# EAGLE schematic board0 (EAGLE 6.0)

## Sheet 1 of 7
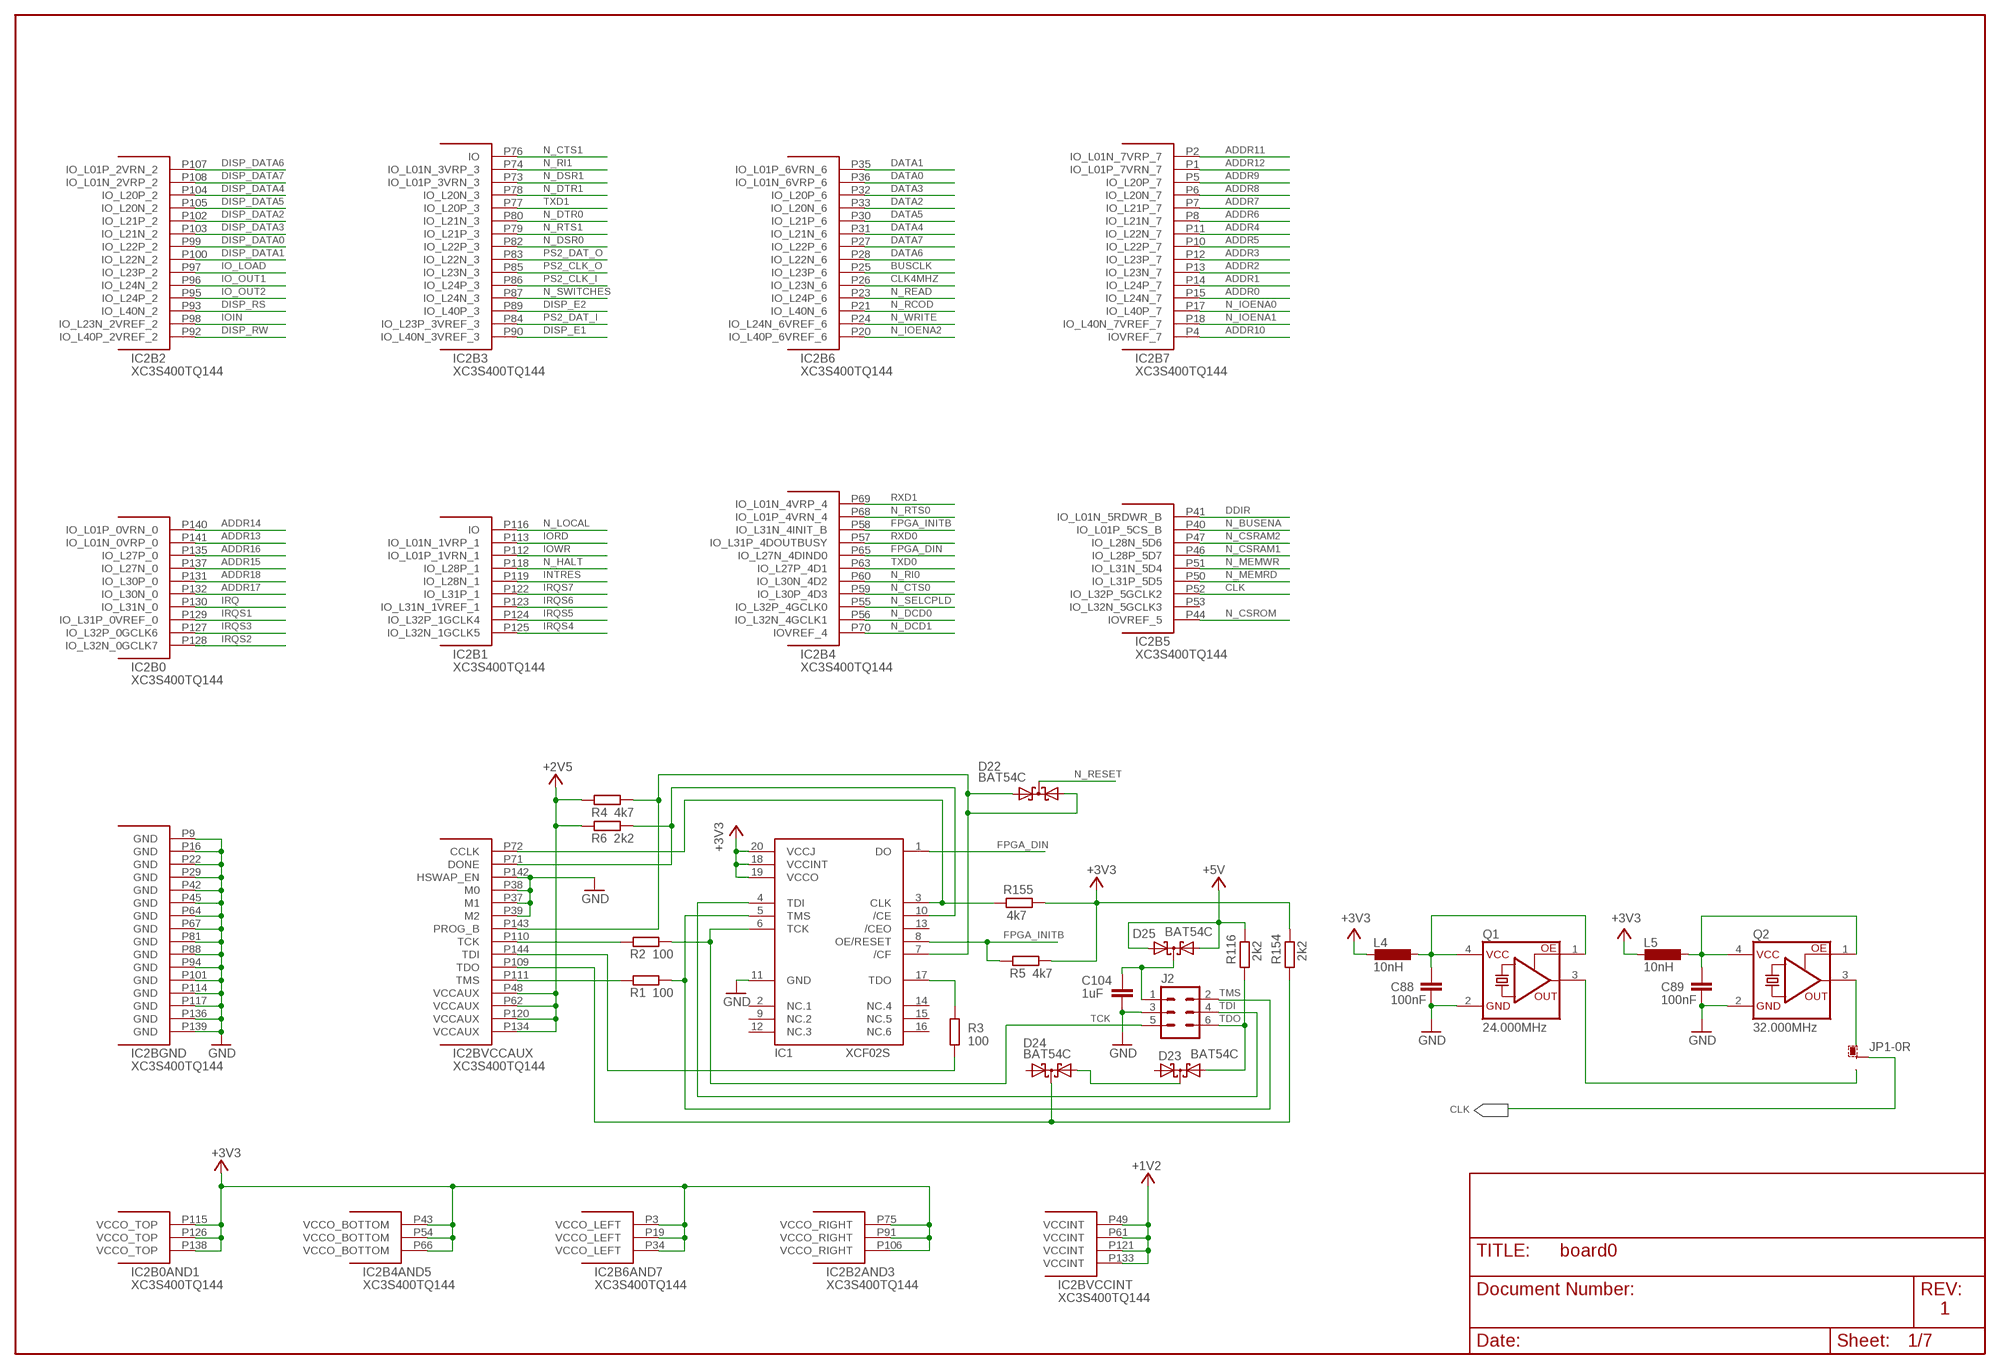
[diagram p0: schematic, sheet 1]

### Parts
C88  100nF  C-EUC0805  [C0805]
C89  100nF  C-EUC0805  [C0805]
C104  1uF  C-EUC0805  [C0805]
D22  BAT54C  BAS40-05  [SOT23]
D23  BAT54C  BAS40-05  [SOT23]
D24  BAT54C  BAS40-05  [SOT23]
D25  BAT54C  BAS40-05  [SOT23]
IC1  XCF02S  [VO20]
IC2  XC3S400TQ144  [TQ144]
J2  ML6  [ML6]
JP1  0R-JUMPA  [A0R-JMP]
L4  10nH  L-0805  [0805]
L5  10nH  L-0805  [0805]
Q1  24.000MHz  XO91  [XO91]
Q2  32.000MHz  XO91  [XO91]
R1  100  R-EU_M0805  [M0805]
R2  100  R-EU_M0805  [M0805]
R3  100  R-EU_M0805  [M0805]
R4  4k7  R-EU_M0805  [M0805]
R5  4k7  R-EU_M0805  [M0805]
R6  2k2  R-EU_M0805  [M0805]
R116  2k2  R-EU_M0805  [M0805]
R154  2k2  R-EU_M0805  [M0805]
R155  4k7  R-EU_M0805  [M0805]

### Nets
+1V2: IC2.P49(BVCCINT:VCCINT) IC2.P61(BVCCINT:VCCINT) IC2.P121(BVCCINT:VCCINT) IC2.P133(BVCCINT:VCCINT) ; also sheet 2
+2V5: IC2.P48(BVCCAUX:VCCAUX) IC2.P62(BVCCAUX:VCCAUX) IC2.P120(BVCCAUX:VCCAUX) IC2.P134(BVCCAUX:VCCAUX) R4.1 R6.1 ; also sheet 2
+3V3: IC1.18(VCCINT) IC1.19(VCCO) IC1.20(VCCJ) IC2.P3(B6AND7:VCCO_LEFT) IC2.P19(B6AND7:VCCO_LEFT) IC2.P34(B6AND7:VCCO_LEFT) IC2.P43(B4AND5:VCCO_BOTTOM) IC2.P54(B4AND5:VCCO_BOTTOM) IC2.P66(B4AND5:VCCO_BOTTOM) IC2.P75(B2AND3:VCCO_RIGHT) IC2.P91(B2AND3:VCCO_RIGHT) IC2.P106(B2AND3:VCCO_RIGHT) IC2.P115(B0AND1:VCCO_TOP) IC2.P126(B0AND1:VCCO_TOP) IC2.P138(B0AND1:VCCO_TOP) L4.2 L5.2 R5.2 R154.2 R155.2 ; also sheet 2
+5V: D25.1(A1) D25.2(A2) R116.2 ; also sheet 2
ADDR0: IC2.P15(B7:IO_L24N_7)
ADDR1: IC2.P14(B7:IO_L24P_7)
ADDR2: IC2.P13(B7:IO_L23N_7)
ADDR3: IC2.P12(B7:IO_L23P_7)
ADDR4: IC2.P11(B7:IO_L22N_7)
ADDR5: IC2.P10(B7:IO_L22P_7)
ADDR6: IC2.P8(B7:IO_L21N_7)
ADDR7: IC2.P7(B7:IO_L21P_7)
ADDR8: IC2.P6(B7:IO_L20N_7)
ADDR9: IC2.P5(B7:IO_L20P_7)
ADDR10: IC2.P4(B7:IOVREF_7)
ADDR11: IC2.P2(B7:IO_L01N_7VRP_7)
ADDR12: IC2.P1(B7:IO_L01P_7VRN_7)
ADDR13: IC2.P141(B0:IO_L01N_0VRP_0)
ADDR14: IC2.P140(B0:IO_L01P_0VRN_0)
ADDR15: IC2.P137(B0:IO_L27N_0)
ADDR16: IC2.P135(B0:IO_L27P_0)
ADDR17: IC2.P132(B0:IO_L30N_0)
ADDR18: IC2.P131(B0:IO_L30P_0)
BUSCLK: IC2.P25(B6:IO_L23P_6)
CLK: IC2.P52(B5:IO_L32P_5GCLK2) JP1.2
CLK4MHZ: IC2.P26(B6:IO_L23N_6)
DATA0: IC2.P36(B6:IO_L01N_6VRP_6)
DATA1: IC2.P35(B6:IO_L01P_6VRN_6)
DATA2: IC2.P33(B6:IO_L20N_6)
DATA3: IC2.P32(B6:IO_L20P_6)
DATA4: IC2.P31(B6:IO_L21N_6)
DATA5: IC2.P30(B6:IO_L21P_6)
DATA6: IC2.P28(B6:IO_L22N_6)
DATA7: IC2.P27(B6:IO_L22P_6)
DDIR: IC2.P41(B5:IO_L01N_5RDWR_B)
DISP_DATA0: IC2.P99(B2:IO_L22P_2)
DISP_DATA1: IC2.P100(B2:IO_L22N_2)
DISP_DATA2: IC2.P102(B2:IO_L21P_2)
DISP_DATA3: IC2.P103(B2:IO_L21N_2)
DISP_DATA4: IC2.P104(B2:IO_L20P_2)
DISP_DATA5: IC2.P105(B2:IO_L20N_2)
DISP_DATA6: IC2.P107(B2:IO_L01P_2VRN_2)
DISP_DATA7: IC2.P108(B2:IO_L01N_2VRP_2)
DISP_E1: IC2.P90(B3:IO_L40N_3VREF_3)
DISP_E2: IC2.P89(B3:IO_L40P_3)
DISP_RS: IC2.P93(B2:IO_L40N_2)
DISP_RW: IC2.P92(B2:IO_L40P_2VREF_2)
FPGA_DIN: IC1.1(DO) IC2.P65(B4:IO_L27N_4DIND0)
FPGA_INITB: IC1.8(OE/RESET) IC2.P58(B4:IO_L31N_4INIT_B) R5.1
GND: C88.2 C89.2 C104.2 IC1.11(GND) IC2.P9(BGND:GND) IC2.P16(BGND:GND) IC2.P22(BGND:GND) IC2.P29(BGND:GND) IC2.P37(BVCCAUX:M1) IC2.P38(BVCCAUX:M0) IC2.P39(BVCCAUX:M2) IC2.P42(BGND:GND) IC2.P45(BGND:GND) IC2.P64(BGND:GND) IC2.P67(BGND:GND) IC2.P81(BGND:GND) IC2.P88(BGND:GND) IC2.P94(BGND:GND) IC2.P101(BGND:GND) IC2.P114(BGND:GND) IC2.P117(BGND:GND) IC2.P136(BGND:GND) IC2.P139(BGND:GND) IC2.P142(BVCCAUX:HSWAP_EN) J2.3 Q1.2(GND) Q2.2(GND) ; also sheet 2,5
INTRES: IC2.P119(B1:IO_L28N_1)
IO_LOAD: IC2.P97(B2:IO_L23P_2)
IO_OUT1: IC2.P96(B2:IO_L24N_2)
IO_OUT2: IC2.P95(B2:IO_L24P_2)
IOIN: IC2.P98(B2:IO_L23N_2VREF_2)
IORD: IC2.P113(B1:IO_L01N_1VRP_1)
IOWR: IC2.P112(B1:IO_L01P_1VRN_1)
IRQ: IC2.P130(B0:IO_L31N_0)
IRQS1: IC2.P129(B0:IO_L31P_0VREF_0)
IRQS2: IC2.P128(B0:IO_L32N_0GCLK7)
IRQS3: IC2.P127(B0:IO_L32P_0GCLK6)
IRQS4: IC2.P125(B1:IO_L32N_1GCLK5)
IRQS5: IC2.P124(B1:IO_L32P_1GCLK4)
IRQS6: IC2.P123(B1:IO_L31N_1VREF_1)
IRQS7: IC2.P122(B1:IO_L31P_1)
N$2: IC1.3(CLK) IC2.P72(BVCCAUX:CCLK) R155.1
N$3: IC1.10(/CE) IC2.P71(BVCCAUX:DONE) R6.2
N$4: IC2.P111(BVCCAUX:TMS) R1.1
N$5: IC2.P110(BVCCAUX:TCK) R2.1
N$8: IC1.17(TDO) R3.2
N$9: IC2.P144(BVCCAUX:TDI) R3.1
N$10: D22.1(A1) D22.2(A2) IC1.7(/CF) IC2.P143(BVCCAUX:PROG_B) R4.2
N$19: C104.1 D25.3(C) J2.1
N$65: JP1.1 Q2.3(FO)
N$66: JP1.3 Q1.3(FO)
N$103: D23.3(C) D24.1(A1)
N_BUSENA: IC2.P40(B5:IO_L01P_5CS_B)
N_CSRAM1: IC2.P46(B5:IO_L28P_5D7)
N_CSRAM2: IC2.P47(B5:IO_L28N_5D6)
N_CSROM: IC2.P44(B5:IOVREF_5)
N_CTS0: IC2.P59(B4:IO_L30P_4D3)
N_CTS1: IC2.P76(B3:IO)
N_DCD0: IC2.P56(B4:IO_L32N_4GCLK1)
N_DCD1: IC2.P70(B4:IOVREF_4)
N_DSR0: IC2.P82(B3:IO_L22P_3)
N_DSR1: IC2.P73(B3:IO_L01P_3VRN_3)
N_DTR0: IC2.P80(B3:IO_L21N_3)
N_DTR1: IC2.P78(B3:IO_L20N_3)
N_HALT: IC2.P118(B1:IO_L28P_1)
N_IOENA0: IC2.P17(B7:IO_L40P_7)
N_IOENA1: IC2.P18(B7:IO_L40N_7VREF_7)
N_IOENA2: IC2.P20(B6:IO_L40P_6VREF_6)
N_LOCAL: IC2.P116(B1:IO)
N_MEMRD: IC2.P50(B5:IO_L31P_5D5)
N_MEMWR: IC2.P51(B5:IO_L31N_5D4)
N_RCOD: IC2.P21(B6:IO_L40N_6)
N_READ: IC2.P23(B6:IO_L24P_6)
N_RESET: D22.3(C)
N_RI0: IC2.P60(B4:IO_L30N_4D2)
N_RI1: IC2.P74(B3:IO_L01N_3VRP_3)
N_RTS0: IC2.P68(B4:IO_L01P_4VRN_4)
N_RTS1: IC2.P79(B3:IO_L21P_3)
N_SELCPLD: IC2.P55(B4:IO_L32P_4GCLK0)
N_SWITCHES: IC2.P87(B3:IO_L24N_3)
N_WRITE: IC2.P24(B6:IO_L24N_6VREF_6)
PS2_CLK_I: IC2.P86(B3:IO_L24P_3)
PS2_CLK_O: IC2.P85(B3:IO_L23N_3)
PS2_DAT_I: IC2.P84(B3:IO_L23P_3VREF_3)
PS2_DAT_O: IC2.P83(B3:IO_L22N_3)
Q1_3V3: C88.1 L4.1 Q1.1(OE) Q1.4(VCC)
Q2_3V3: C89.1 L5.1 Q2.1(OE) Q2.4(VCC)
RXD0: IC2.P57(B4:IO_L31P_4DOUTBUSY)
RXD1: IC2.P69(B4:IO_L01N_4VRP_4)
TCK: IC1.6(TCK) J2.5 R2.2
TDI: IC1.4(TDI) J2.4
TDO: D24.3(C) IC2.P109(BVCCAUX:TDO) R154.1
TDO_JTAG: D23.1(A1) J2.6 R116.1
TMS: IC1.5(TMS) J2.2 R1.2
TXD0: IC2.P63(B4:IO_L27P_4D1)
TXD1: IC2.P77(B3:IO_L20P_3)
Unconnected: D23.2(A2) D24.2(A2) IC1.2(NC.1) IC1.9(NC.2) IC1.12(NC.3) IC1.13(/CEO) IC1.14(NC.4) IC1.15(NC.5) IC1.16(NC.6) IC2.P53(B5:IO_L32N_5GCLK3)

### Notes on the sheet
- 1

## Sheet 2 of 7
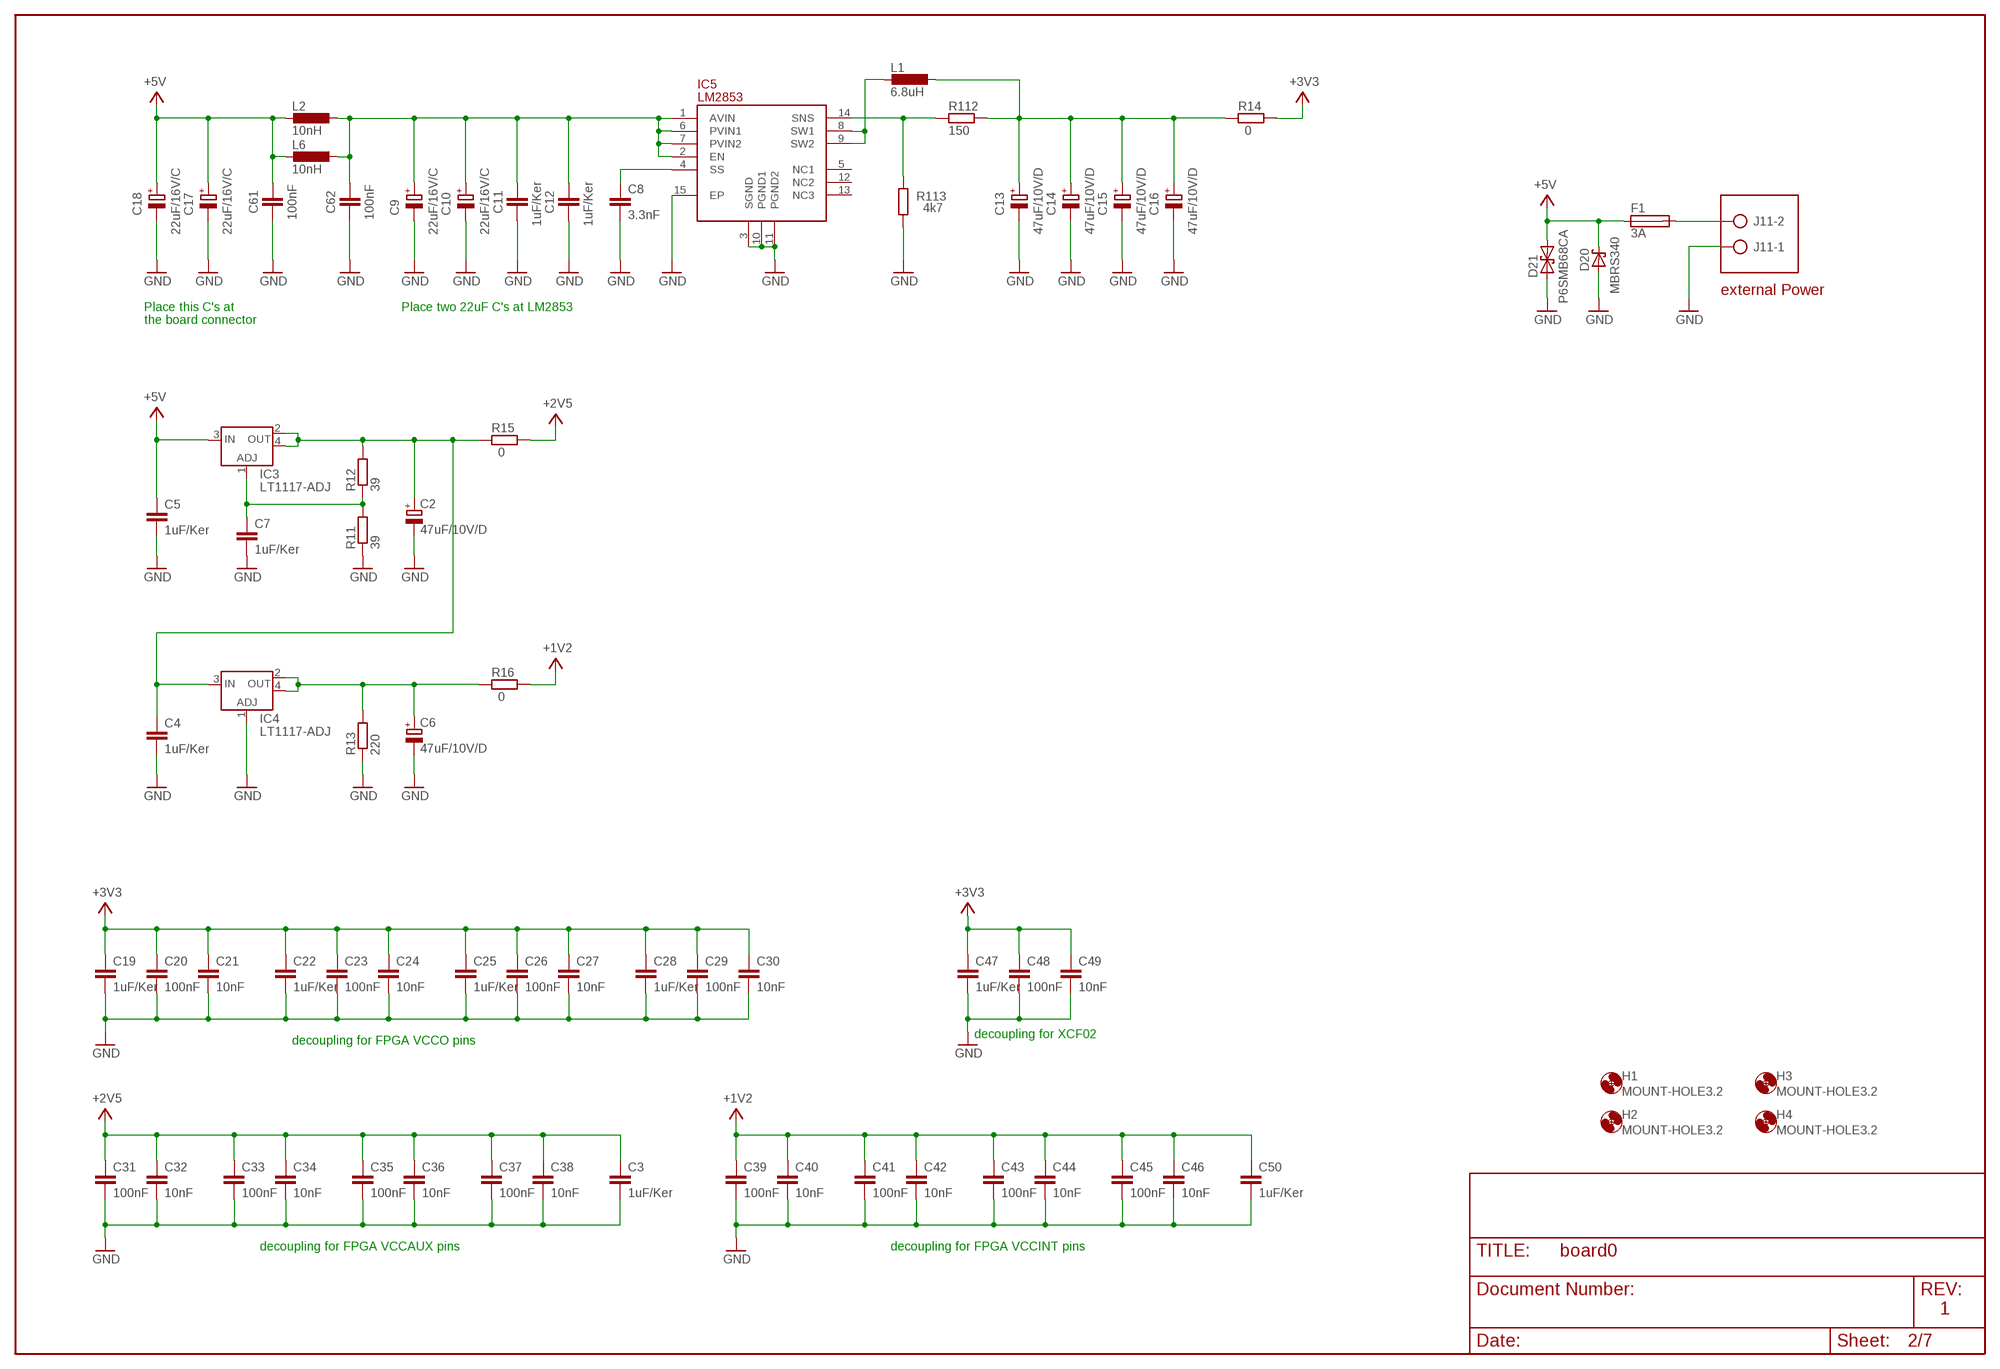
[diagram p1: schematic, sheet 2]

### Parts
C2  47uF/10V/D  CPOL-EUD/7343-31R  [D/7343-31R]
C3  1uF/Ker  C-EUC0805  [C0805]
C4  1uF/Ker  C-EUC0805  [C0805]
C5  1uF/Ker  C-EUC0805  [C0805]
C6  47uF/10V/D  CPOL-EUD/7343-31R  [D/7343-31R]
C7  1uF/Ker  C-EUC0805  [C0805]
C8  3.3nF  C-EUC0805  [C0805]
C9  22uF/16V/C  CPOL-EUC/6032-28R  [C/6032-28R]
C10  22uF/16V/C  CPOL-EUC/6032-28R  [C/6032-28R]
C11  1uF/Ker  C-EUC0805  [C0805]
C12  1uF/Ker  C-EUC0805  [C0805]
C13  47uF/10V/D  CPOL-EUD/7343-31R  [D/7343-31R]
C14  47uF/10V/D  CPOL-EUD/7343-31R  [D/7343-31R]
C15  47uF/10V/D  CPOL-EUD/7343-31R  [D/7343-31R]
C16  47uF/10V/D  CPOL-EUD/7343-31R  [D/7343-31R]
C17  22uF/16V/C  CPOL-EUC/6032-28R  [C/6032-28R]
C18  22uF/16V/C  CPOL-EUC/6032-28R  [C/6032-28R]
C19  1uF/Ker  C-EUC0805  [C0805]
C20  100nF  C-EUC0805  [C0805]
C21  10nF  C-EUC0805  [C0805]
C22  1uF/Ker  C-EUC0805  [C0805]
C23  100nF  C-EUC0805  [C0805]
C24  10nF  C-EUC0805  [C0805]
C25  1uF/Ker  C-EUC0805  [C0805]
C26  100nF  C-EUC0805  [C0805]
C27  10nF  C-EUC0805  [C0805]
C28  1uF/Ker  C-EUC0805  [C0805]
C29  100nF  C-EUC0805  [C0805]
C30  10nF  C-EUC0805  [C0805]
C31  100nF  C-EUC0805  [C0805]
C32  10nF  C-EUC0805  [C0805]
C33  100nF  C-EUC0805  [C0805]
C34  10nF  C-EUC0805  [C0805]
C35  100nF  C-EUC0805  [C0805]
C36  10nF  C-EUC0805  [C0805]
C37  100nF  C-EUC0805  [C0805]
C38  10nF  C-EUC0805  [C0805]
C39  100nF  C-EUC0805  [C0805]
C40  10nF  C-EUC0805  [C0805]
C41  100nF  C-EUC0805  [C0805]
C42  10nF  C-EUC0805  [C0805]
C43  100nF  C-EUC0805  [C0805]
C44  10nF  C-EUC0805  [C0805]
C45  100nF  C-EUC0805  [C0805]
C46  10nF  C-EUC0805  [C0805]
C47  1uF/Ker  C-EUC0805  [C0805]
C48  100nF  C-EUC0805  [C0805]
C49  10nF  C-EUC0805  [C0805]
C50  1uF/Ker  C-EUC0805  [C0805]
C61  100nF  C-EUC0805  [C0805]
C62  100nF  C-EUC0805  [C0805]
D20  MBRS340  [DO214AB]
D21  P6SMB68CA  [DO214AA]
F1  3A  FUSE-HASF  [HASF]
H1  MOUNT-HOLE3.2  [3,2]
H2  MOUNT-HOLE3.2  [3,2]
H3  MOUNT-HOLE3.2  [3,2]
H4  MOUNT-HOLE3.2  [3,2]
IC3  LT1117-ADJ  [SOT223]
IC4  LT1117-ADJ  [SOT223]
IC5  LM2853  [ETSSOP14]
J11  AK500/2  [AK500/2]
L1  6.8uH  DO3316P  [DO3316P]
L2  10nH  L-0805  [0805]
L6  10nH  L-0805  [0805]
R11  39  R-EU_R0805  [R0805]
R12  39  R-EU_R0805  [R0805]
R13  220  R-EU_R0805  [R0805]
R14  0  R-EU_R0805  [R0805]
R15  0  R-EU_R0805  [R0805]
R16  0  R-EU_R0805  [R0805]
R112  150  R-EU_R0805  [R0805]
R113  4k7  R-EU_R0805  [R0805]

### Nets
3V3OUT: C13.+ C14.+ C15.+ C16.+ L1.2 R14.1 R112.2
5V_SREG: C9.+ C10.+ C11.1 C12.1 C62.1 IC5.1(AVIN) IC5.2(EN) IC5.6(PVIN1) IC5.7(PVIN2) L2.1 L6.1
+1V2: C39.1 C40.1 C41.1 C42.1 C43.1 C44.1 C45.1 C46.1 C50.1 R16.2 ; also sheet 1
+2V5: C3.1 C31.1 C32.1 C33.1 C34.1 C35.1 C36.1 C37.1 C38.1 R15.2 ; also sheet 1
+3V3: C19.1 C20.1 C21.1 C22.1 C23.1 C24.1 C25.1 C26.1 C27.1 C28.1 C29.1 C30.1 C47.1 C48.1 C49.1 R14.2 ; also sheet 1
+5V: C5.1 C17.+ C18.+ C61.1 D20.K(C) D21.K(C) F1.1 IC3.3(IN) L2.2 L6.2 ; also sheet 1
GND: C2.- C3.2 C4.2 C5.2 C6.- C7.2 C8.2 C9.- C10.- C11.2 C12.2 C13.- C14.- C15.- C16.- C17.- C18.- C19.2 C20.2 C21.2 C22.2 C23.2 C24.2 C25.2 C26.2 C27.2 C28.2 C29.2 C30.2 C31.2 C32.2 C33.2 C34.2 C35.2 C36.2 C37.2 C38.2 C39.2 C40.2 C41.2 C42.2 C43.2 C44.2 C45.2 C46.2 C47.2 C48.2 C49.2 C50.2 C61.2 C62.2 D20.A D21.A IC4.1(ADJ) IC5.3(SGND) IC5.10(PGND1) IC5.11(PGND2) IC5.15(EP) J11.1 R11.1 R13.1 R113.1 ; also sheet 1,5
N$7: C7.1 IC3.1(ADJ) R11.2 R12.1
N$11: IC5.8(SW1) IC5.9(SW2) L1.1
N$13: C8.1 IC5.4(SS)
N$15: C6.+ IC4.2(OUT) IC4.4(OUT1) R13.2 R16.1
N$63: C2.+ C4.1 IC3.2(OUT) IC3.4(OUT1) IC4.3(IN) R12.2 R15.1
N$69: IC5.14(SNS) R112.1 R113.2
N$90: F1.2 J11.2
Unconnected: IC5.5(NC1) IC5.12(NC2) IC5.13(NC3)

### Notes on the sheet
- external Power
- Place this C's at | Place two 22uF C's at LM2853
- the board connector
- decoupling for XCF02
- decoupling for FPGA VCCO pins
- decoupling for FPGA VCCAUX pins | decoupling for FPGA VCCINT pins
- 1

## Sheet 3 of 7
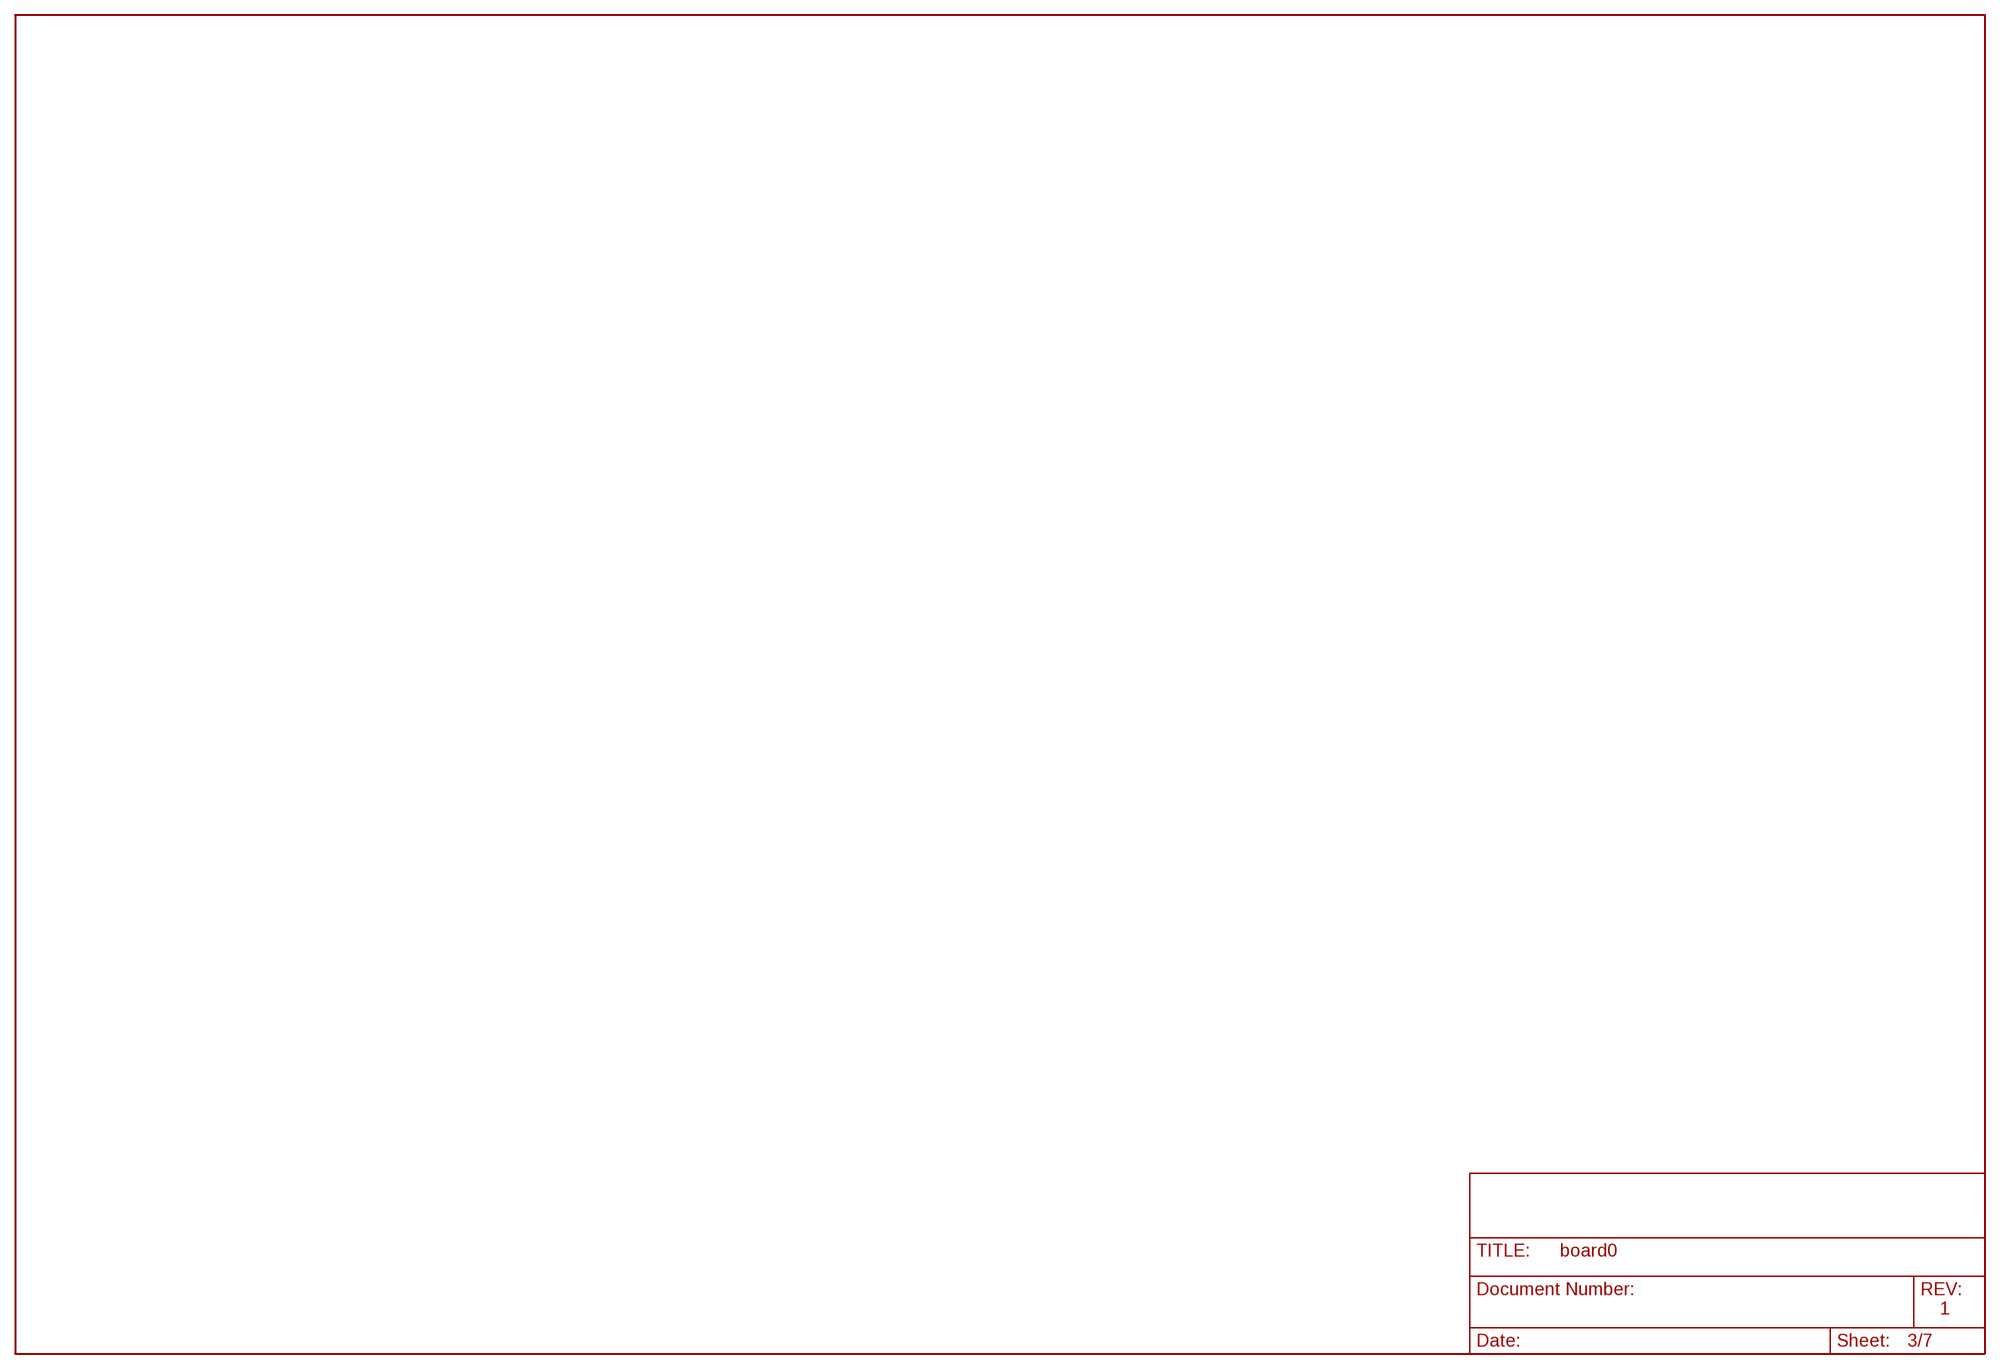
[diagram p2: schematic, sheet 3]

### Notes on the sheet
- 1

## Sheet 4 of 7
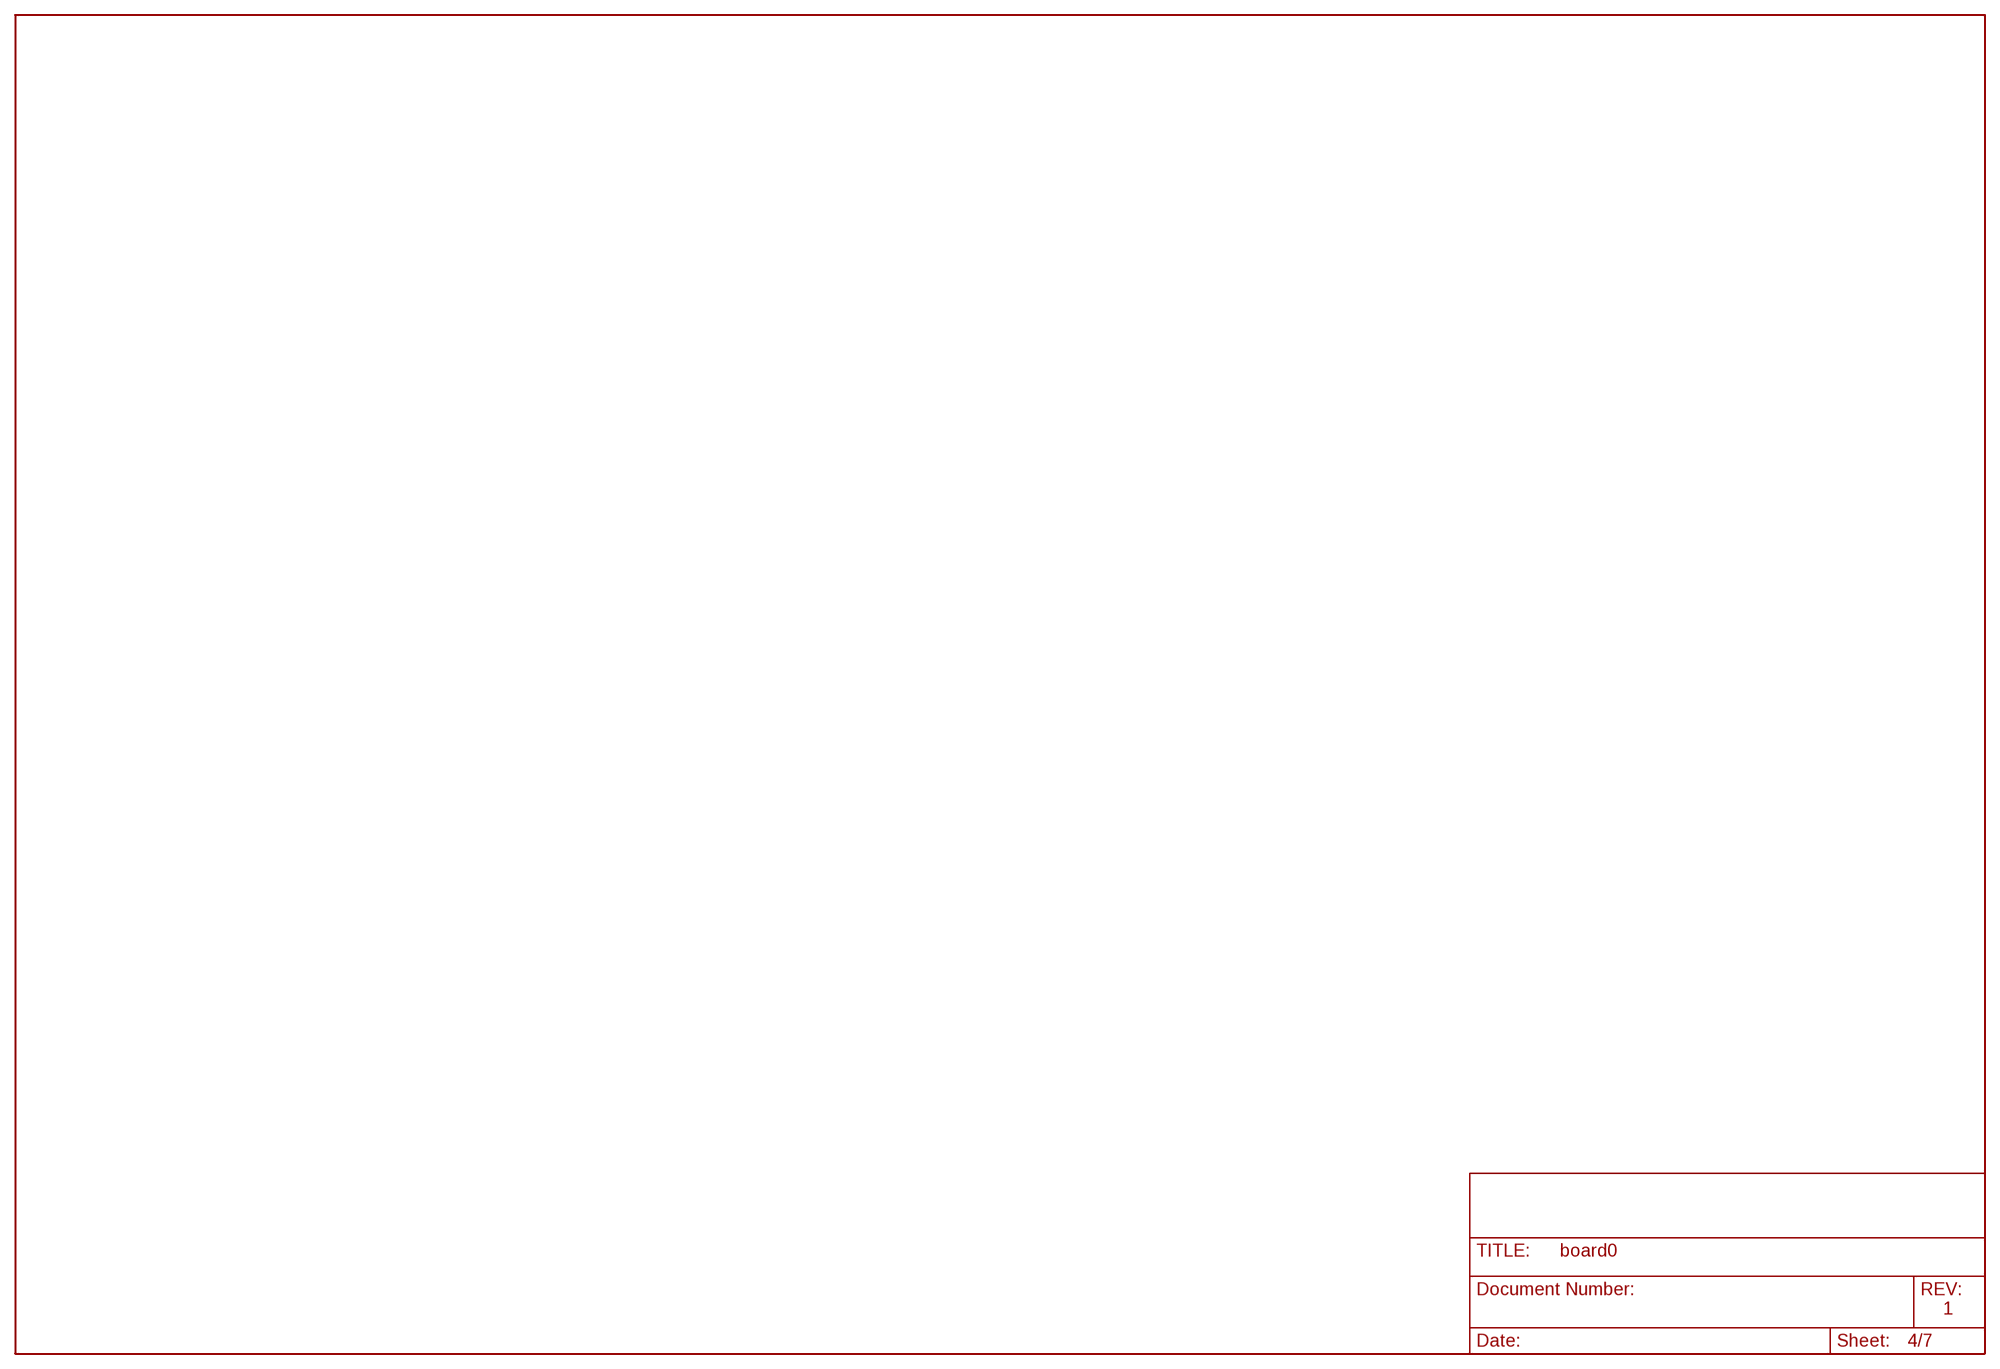
[diagram p3: schematic, sheet 4]

### Notes on the sheet
- 1

## Sheet 5 of 7
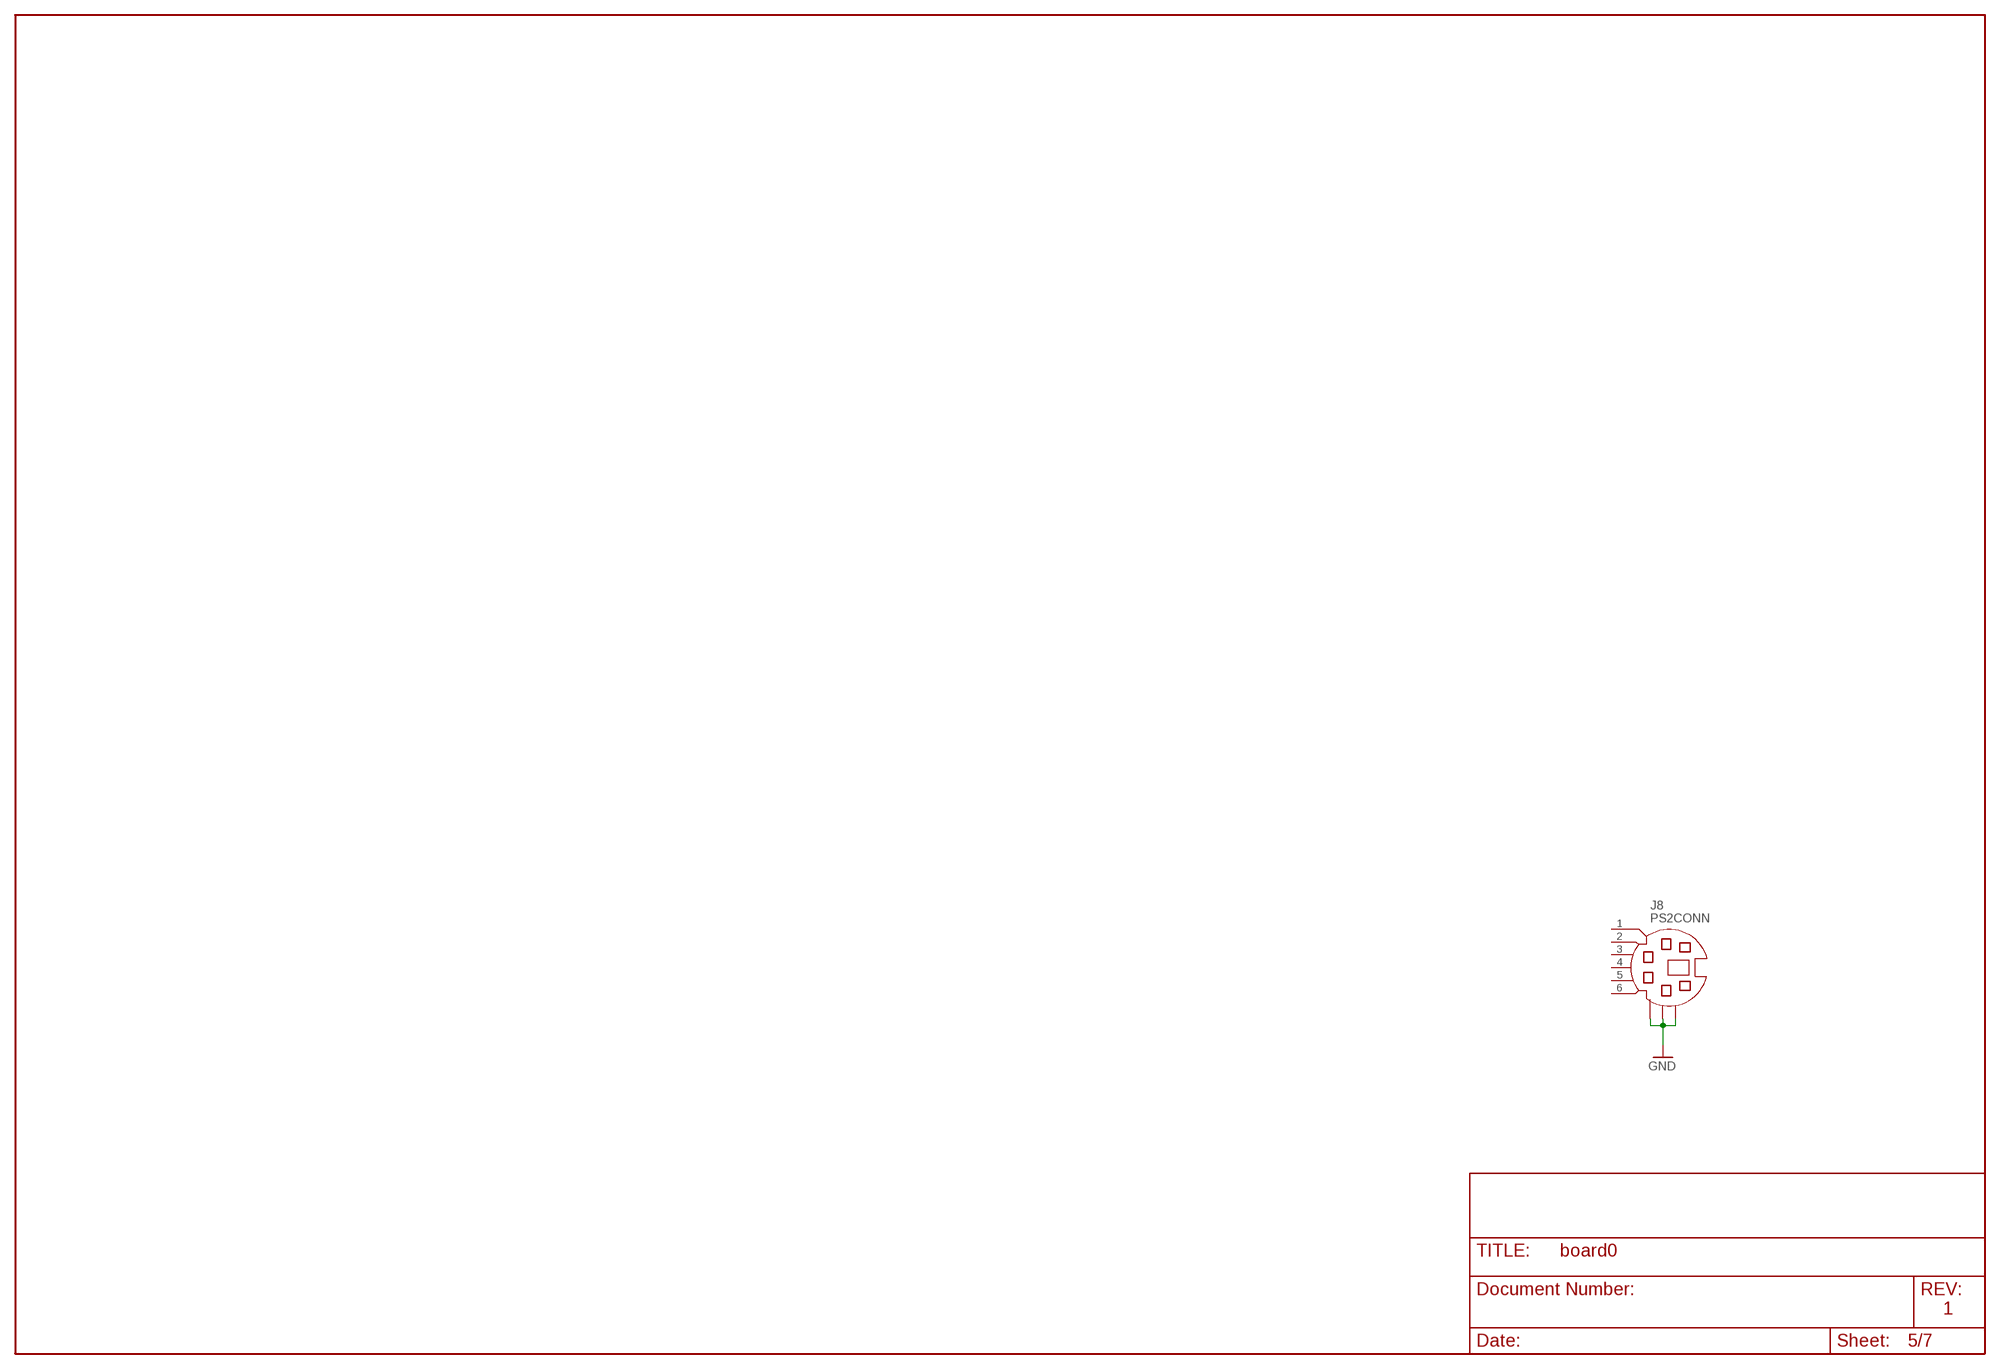
[diagram p4: schematic, sheet 5]

### Parts
J8  PS2CONN  [MINIDIN-6]

### Nets
GND: J8.SHIELD.1 J8.SHIELD.2 J8.SHIELD.3 ; also sheet 1,2
Unconnected: J8.1 J8.2 J8.3 J8.4 J8.5 J8.6

### Notes on the sheet
- 1

## Sheet 6 of 7
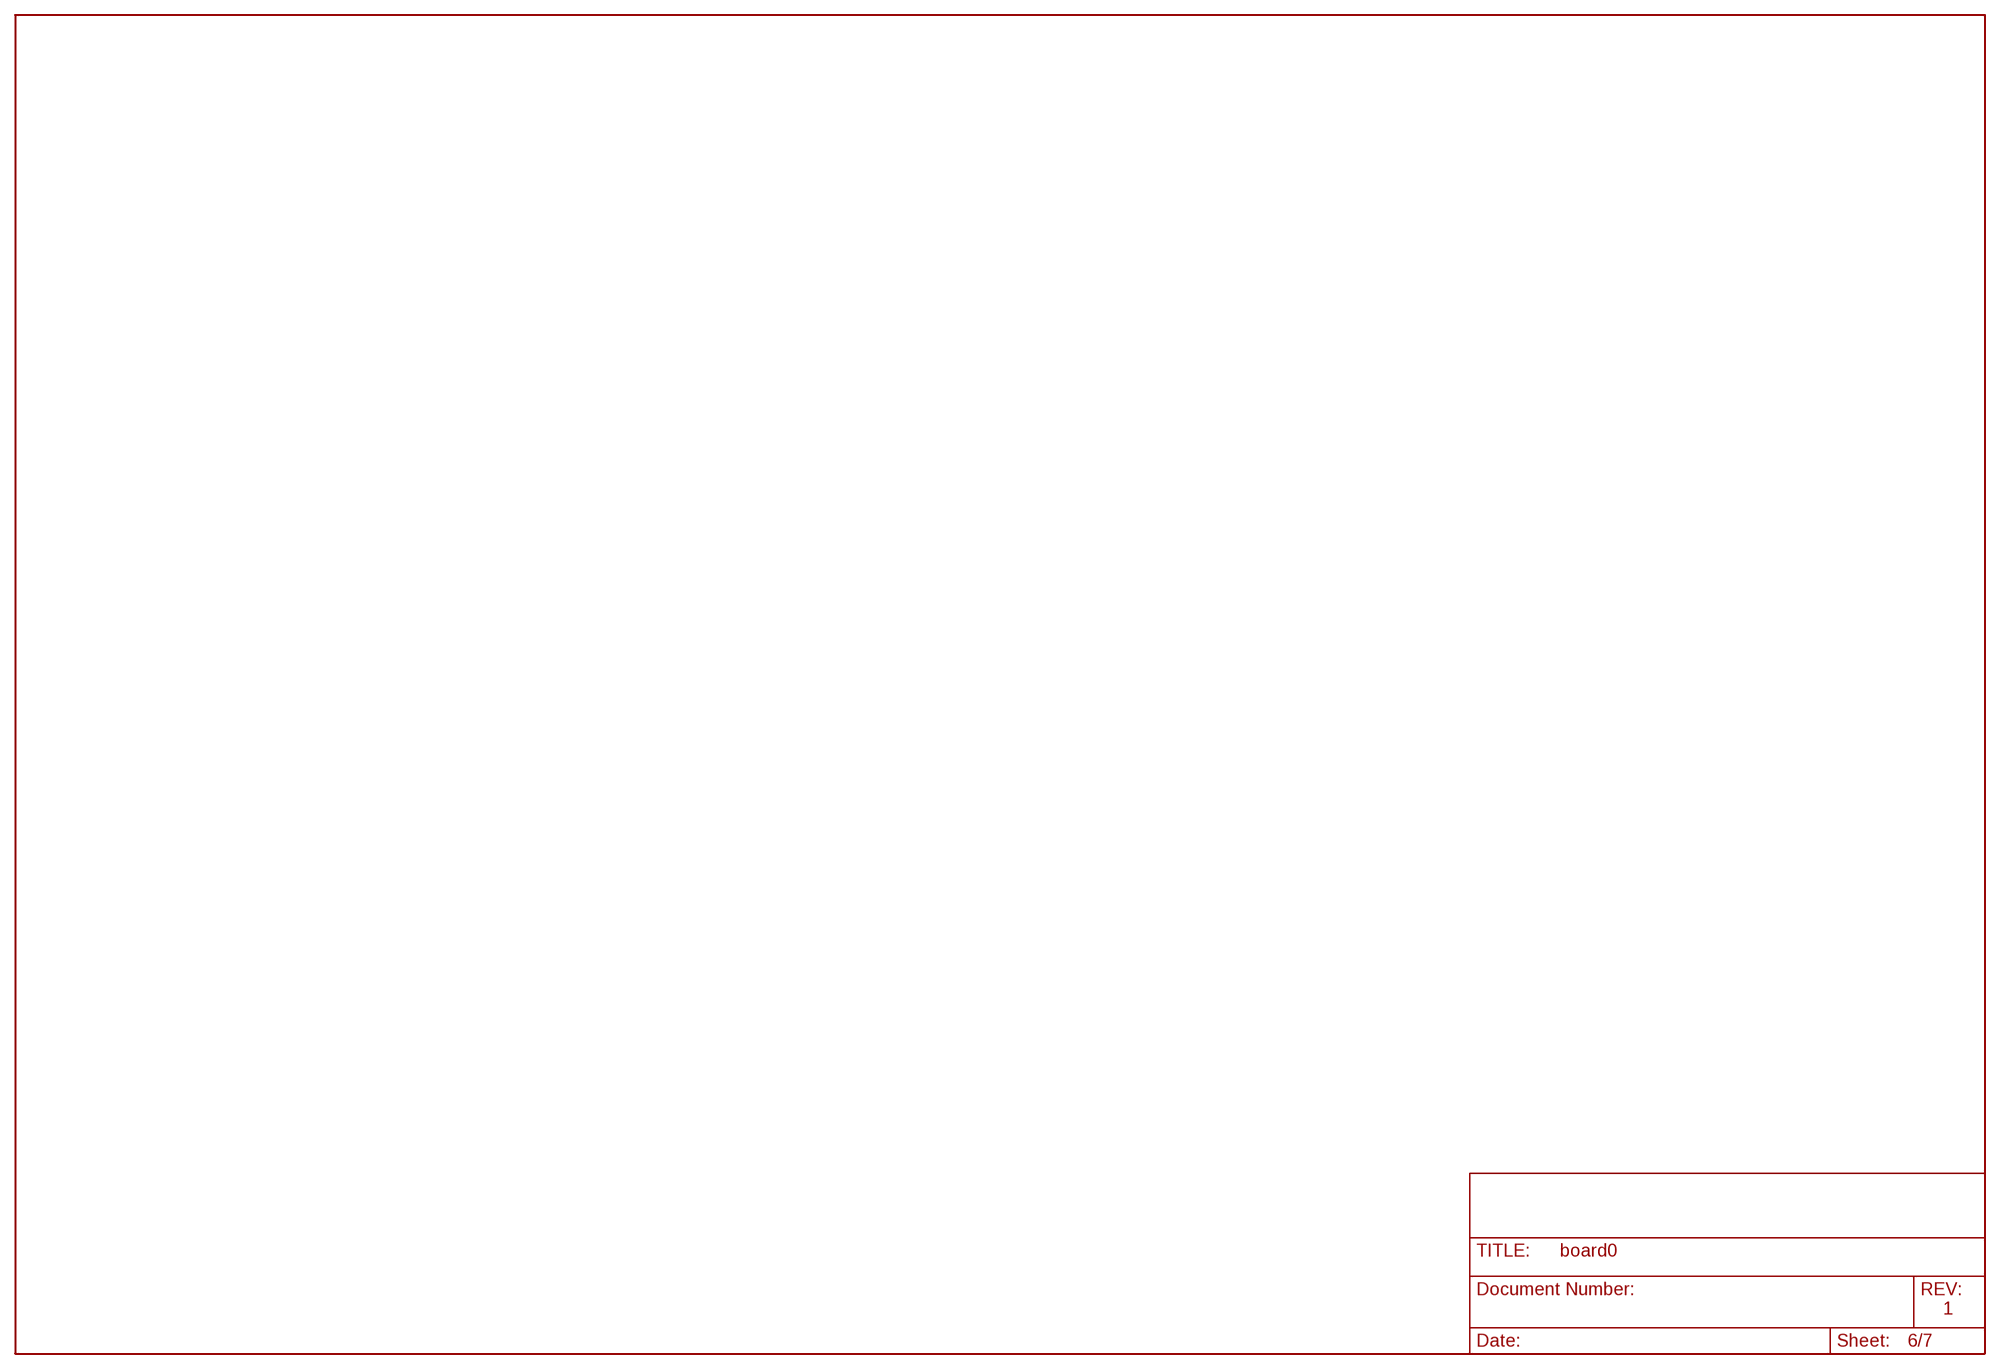
[diagram p5: schematic, sheet 6]

### Notes on the sheet
- 1

## Sheet 7 of 7
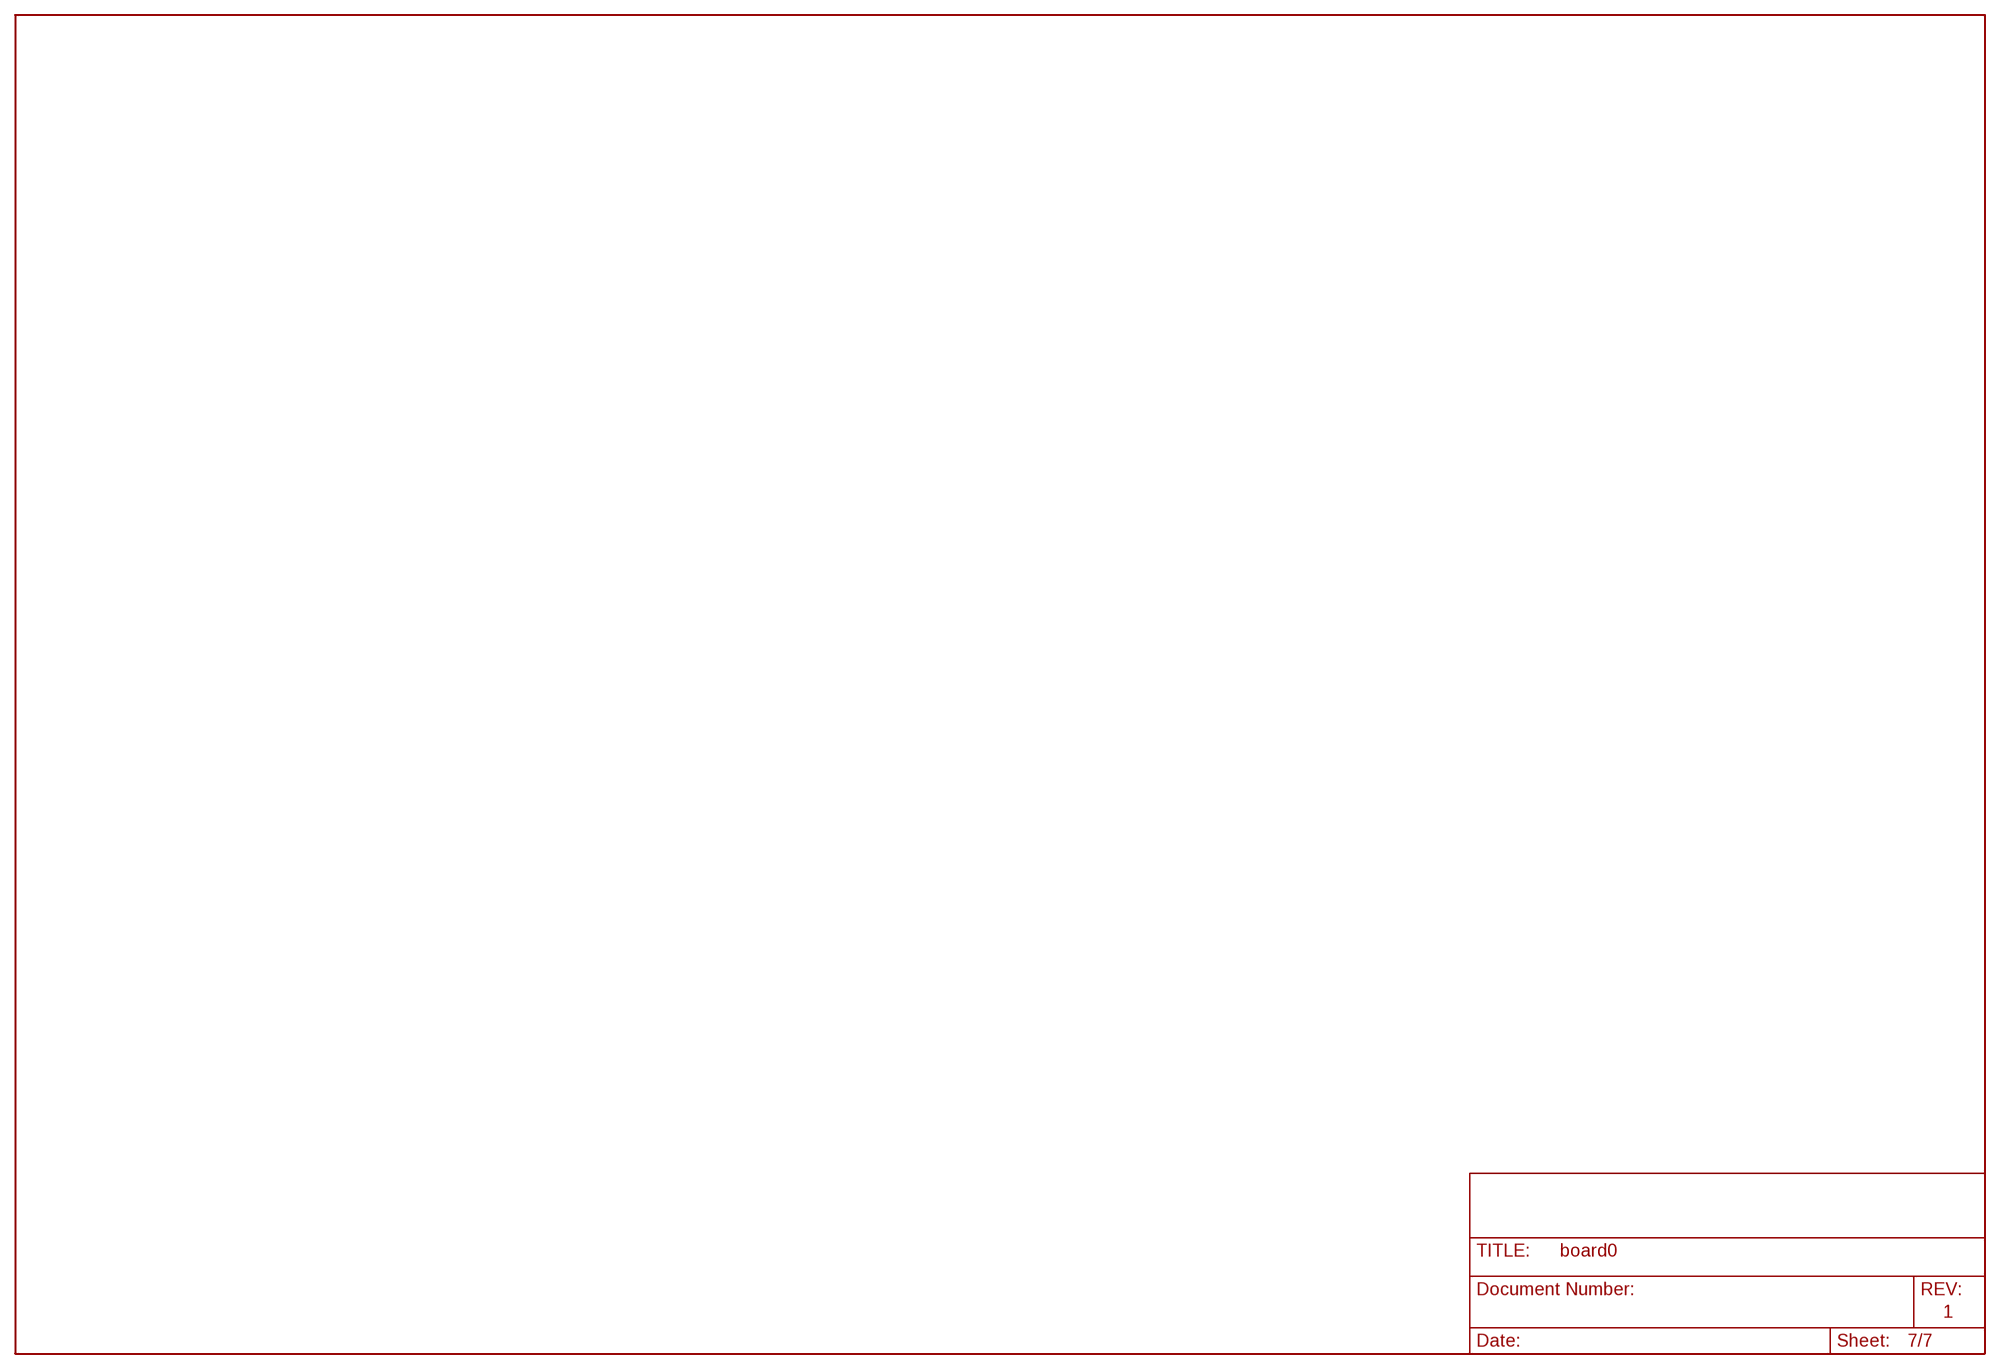
[diagram p6: schematic, sheet 7]

### Notes on the sheet
- 1

## Library data of the parts
C2 C6 C9 C10 C13-C18 = rcl:CPOL-EU: POLARIZED CAPACITOR, European symbol
C3-C5 C7 C8 C11 C12 C19-C50 C61 C62 C88 C89 C104 = rcl:C-EU: CAPACITOR, European symbol
D20 = dk-special:MBRS340
D21 = dk-special:P6SMB68CA
D22-D25 = diode:BAS40-05: Silicon Schottky Diodes General-purpose diode for high-speed switching
F1 = dk-special:FUSE-HASF
H1-H4 = holes:MOUNT-HOLE: MOUNTING HOLE with drill center marker
IC1 = smd-special:XCF02S
IC2 = xilinx_devices:XC3S400TQ144: Xilinx FPGA: XC3S400tq144
IC3 IC4 = smd-special:LT1117-ADJ
IC5 = smd-special:LM2853
J2 = con-harting-ml:ML6: HARTING
J8 = dk-special:PS2CONN
J11 = con-ptr500:AK500/2: CONNECTOR
JP1 = jump-0r-smd:0R-JUMP: SMD 0R 0805 Jumper
L1 = inductor-coilcraft:DO3316P: COILCRAFT
L2 L6 = smd-special:L-0805
L4 L5 = dk-special:L-0805
Q1 Q2 = dk-special:XO91
R1-R6 R11-R16 R112 R113 R116 R154 R155 = rcl:R-EU_: RESISTOR, European symbol